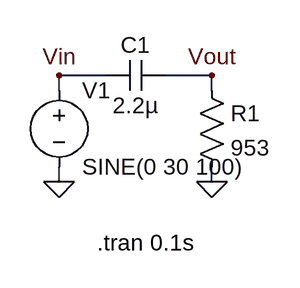
[diagram p0: schematic prova_RC.asc]
prova_RC.asc, the LTspice schematic file:
Version 4
SHEET 1 880 680
WIRE 256 256 208 256
WIRE 368 256 320 256
WIRE 208 272 208 256
WIRE 368 272 368 256
WIRE 208 368 208 352
WIRE 368 368 368 352
FLAG 208 368 0
FLAG 208 256 Vin
FLAG 368 256 Vout
FLAG 368 368 0
SYMBOL /res 352 256 R0
SYMATTR InstName R1
SYMATTR Value 953
SYMBOL /cap 320 240 R90
WINDOW 0 0 32 VBottom 2
WINDOW 3 32 32 VTop 2
SYMATTR InstName C1
SYMATTR Value 2.2µ
SYMATTR SpiceLine V=X mfg=" ---" pn=" ---" type=" ---"
SYMBOL /voltage 208 256 R0
WINDOW 39 24 118 Left 2
SYMATTR InstName V1
SYMATTR Value SINE(0 30 100)
TEXT 248 432 Left 2 !.tran 0.1s

The netlist it stands for:
* prova_RC.asc
R1 Vout 0 953
C1 Vout Vin 2.2µ V=X mfg=" ---" pn=" ---" type=" ---"
V1 Vin 0 SINE(0 30 100)
.tran 0.1s
.backanno
.end

* Results of the author's LTspice run, read from the files saved beside the schematic
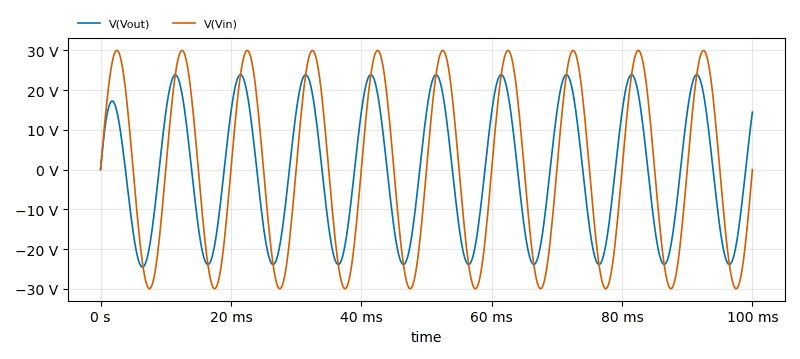
[diagram p1: Transient Analysis of prova_RC.asc, plotted from the saved traces]
* Transient Analysis, 1 run:
*   V(Vout): min -24.53 V, max 23.87 V, average -302.4 mV, rms 16.69 V, last 14.45 V
*   V(Vin): min -29.97 V, max 29.97 V, average 765.9 µV, rms 21.19 V, last 0 V